# Altium schematic sheet Inverter.SchDoc: Three-Phase Inverter
size 292 x 193 mm; Author: Lucas A. Kammann; DrawnBy: Lucas A. Kammann; Revision: 0.0; SheetNumber: 1; SheetTotal: 2; Project: Three-Phase Inverter; Authors: Lucas A. Kammann; Group: 3
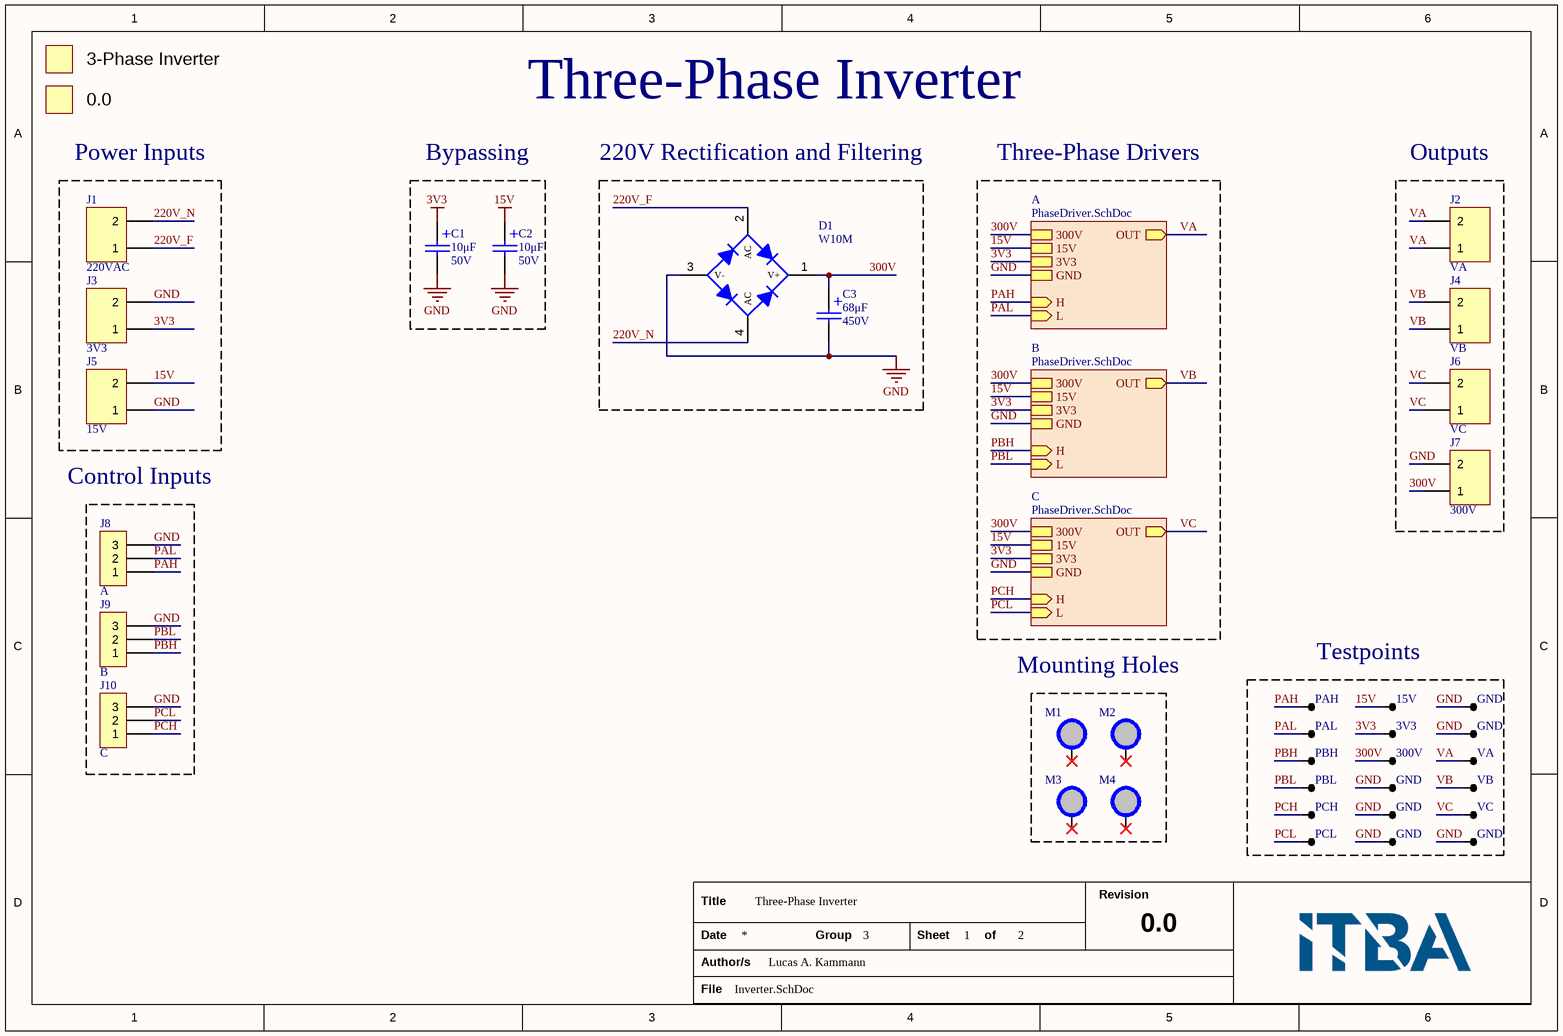
[diagram p0: Inverter.SchDoc]

## Parts
B1  Name: 3-Phase Inverter  [MISC_BOARD]  (hidden comment: Board Name)  (no BOM)
C1  value 10μF  Voltage Rating: 50V  [CAP100RP]  (hidden comment: CAPPOL)
C2  value 10μF  Voltage Rating: 50V  [CAP100RP]  (hidden comment: CAPPOL)
C3  value 68μF  Voltage Rating: 450V  [CAP_8mm]  (hidden comment: CAPPOL)
D1  W10M  [PUENTE - W10M]
J1  220VAC  [BORNERA2]
J2  VA  [BORNERA2]
J3  3V3  [BORNERA2]
J4  VB  [BORNERA2]
J5  15V  [BORNERA2]
J6  VC  [BORNERA2]
J7  300V  [BORNERA2]
J8  A  [SIP3]
J9  B  [SIP3]
J10  C  [SIP3]
M1  Mounting Hole  [MISC_MOUNTING_HOLE_M3]  (value not drawn)  (no BOM)
M2  Mounting Hole  [MISC_MOUNTING_HOLE_M3]  (value not drawn)  (no BOM)
M3  Mounting Hole  [MISC_MOUNTING_HOLE_M3]  (value not drawn)  (no BOM)
M4  Mounting Hole  [MISC_MOUNTING_HOLE_M3]  (value not drawn)  (no BOM)
TP1  PAH  [TPTH]
TP2  15V  [TPTH]
TP3  GND  [TPTH]
TP4  PAL  [TPTH]
TP5  3V3  [TPTH]
TP6  GND  [TPTH]
TP7  PBH  [TPTH]
TP8  300V  [TPTH]
TP9  VA  [TPTH]
TP10  PBL  [TPTH]
TP11  GND  [TPTH]
TP12  VB  [TPTH]
TP13  PCH  [TPTH]
TP14  GND  [TPTH]
TP15  VC  [TPTH]
TP16  PCL  [TPTH]
TP17  GND  [TPTH]
TP18  GND  [TPTH]
V1  Version: 0.0  [MISC_VERSION]  (hidden comment: PCB Version)  (no BOM)

## Blocks framed on the sheet
Power Inputs: J1 J3 J5
Bypassing: C1 C2
220V Rectification and Filtering: C3 D1
Outputs: J2 J4 J6 J7
Control Inputs: J8-J10
Mounting Holes: M1-M4
Testpoints: TP1-TP18

## Sub-sheets
A = PhaseDriver.SchDoc: 15V, 3V3, GND, H (in), L (in), OUT (out), 300V
B = PhaseDriver.SchDoc: 15V, 3V3, GND, H (in), L (in), OUT (out), 300V
C = PhaseDriver.SchDoc: 15V, 3V3, GND, H (in), L (in), OUT (out), 300V

## Nets
3V3: C1.1 J3.1 TP5.1 ; sheet A/3V3, sheet B/3V3, sheet C/3V3
15V: C2.1 J5.2 TP2.1 ; sheet A/15V, sheet B/15V, sheet C/15V
GND: C1.2 C2.2 C3.2 D1.3(V-) J3.2 J5.1 J7.2 J8.3 J9.3 J10.3 TP3.1 TP6.1 TP11.1 TP14.1 TP17.1 TP18.1 ; sheet A/GND, sheet B/GND, sheet C/GND
220V_F: D1.2(AC) J1.1
220V_N: D1.4(AC) J1.2
300V: C3.1 D1.1(V+) J7.1 TP8.1 ; sheet A/300V, sheet B/300V, sheet C/300V
PAH: J8.1 TP1.1 ; sheet A/H
PAL: J8.2 TP4.1 ; sheet A/L
PBH: J9.1 TP7.1 ; sheet B/H
PBL: J9.2 TP10.1 ; sheet B/L
PCH: J10.1 TP13.1 ; sheet C/H
PCL: J10.2 TP16.1 ; sheet C/L
VA: J2.1 J2.2 TP9.1 ; sheet A/OUT
VB: J4.1 J4.2 TP12.1 ; sheet B/OUT
VC: J6.1 J6.2 TP15.1 ; sheet C/OUT

Not connected (* = marked no-connect by the designer): M1 1*; M2 1*; M3 1*; M4 1*

## Notes on the sheet
- Three-Phase Inverter
- Three-Phase Drivers
- Title
- Revision
- Date
- Author/s
- Group
- Sheet
- of
- File
- (in symbol CAPACITOR POLARIZADO) +

## Library data of the parts
B1 = MISC_BOARD
C1-C3 = CAPACITOR POLARIZADO: Manufacturer Part Number: -; Manufacturer: -
J1-J7 = BORNERA 2: BORNERA 2 POLOS; Manufacturer Part Number: -; Manufacturer: -
J8-J10 = CON3
M1-M4 = MISC_MOUNTING_HOLE_M3: MOUNTING HOLE M2.5
TP1-TP18 = TP: TESTPOINT
V1 = MISC_VERSION